# EAGLE schematic driver_schnellx (EAGLE 5.11)
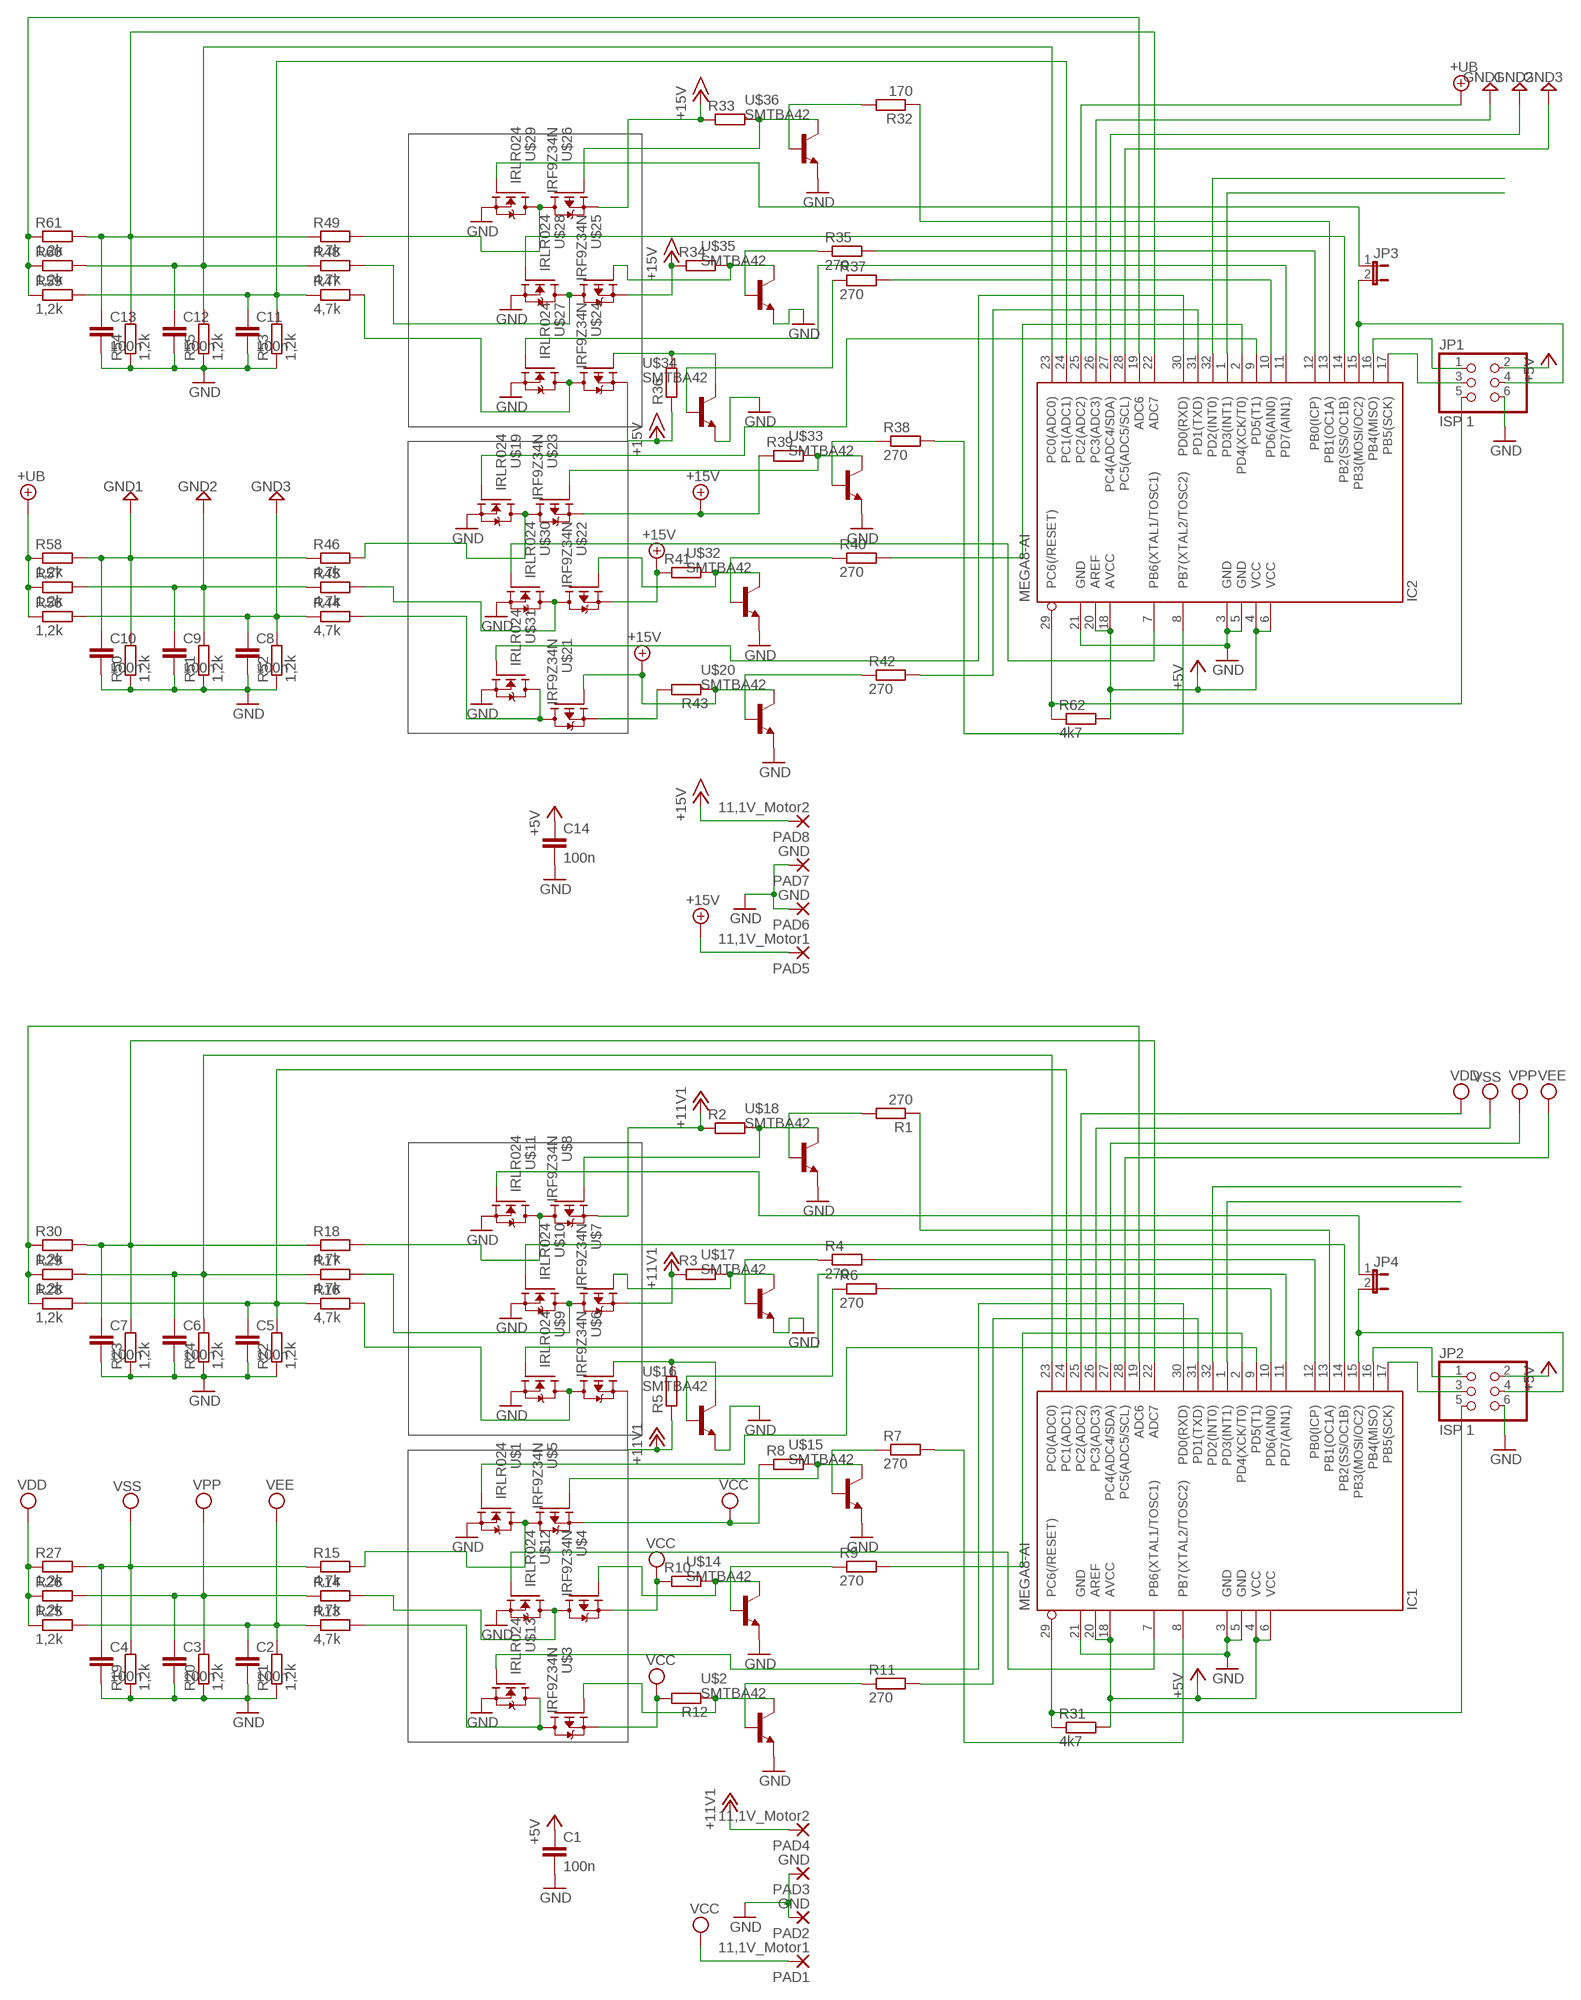
[diagram p0: schematic, sheet 1]

## Parts
C1  100n  C-EUC0805  [C0805]
C2  100n  C-EUC0805  [C0805]
C3  100n  C-EUC0805  [C0805]
C4  100n  C-EUC0805  [C0805]
C5  100n  C-EUC0805  [C0805]
C6  100n  C-EUC0805  [C0805]
C7  100n  C-EUC0805  [C0805]
C8  100n  C-EUC0805  [C0805]
C9  100n  C-EUC0805  [C0805]
C10  100n  C-EUC0805  [C0805]
C11  100n  C-EUC0805  [C0805]
C12  100n  C-EUC0805  [C0805]
C13  100n  C-EUC0805  [C0805]
C14  100n  C-EUC0805  [C0805]
IC1  MEGA8-AI  [TQFP32-08]
IC2  MEGA8-AI  [TQFP32-08]
JP1  ISP 1  PINHD-2X3  [2X03]
JP2  ISP 1  PINHD-2X3  [2X03]
JP3  JP1E  [JP1]
JP4  JP1E  [JP1]
PAD1  11,1V_Motor1  3,17/1,3  [3,17/1,3]
PAD2  GND  3,17/1,3  [3,17/1,3]
PAD3  GND  3,17/1,3  [3,17/1,3]
PAD4  11,1V_Motor2  3,17/1,3  [3,17/1,3]
PAD5  11,1V_Motor1  3,17/1,3  [3,17/1,3]
PAD6  GND  3,17/1,3  [3,17/1,3]
PAD7  GND  3,17/1,3  [3,17/1,3]
PAD8  11,1V_Motor2  3,17/1,3  [3,17/1,3]
R1  270  R-EU_M0805  [M0805]
R2  R-EU_0204/5  [0204/5]
R3  R-EU_0204/5  [0204/5]
R4  270  R-EU_M0805  [M0805]
R5  R-EU_0204/5  [0204/5]
R6  270  R-EU_M0805  [M0805]
R7  270  R-EU_M0805  [M0805]
R8  R-EU_0204/5  [0204/5]
R9  270  R-EU_M0805  [M0805]
R10  R-EU_0204/5  [0204/5]
R11  270  R-EU_M0805  [M0805]
R12  R-EU_0204/5  [0204/5]
R13  4,7k  R-EU_M0805  [M0805]
R14  4,7k  R-EU_M0805  [M0805]
R15  4,7k  R-EU_M0805  [M0805]
R16  4,7k  R-EU_M0805  [M0805]
R17  4,7k  R-EU_M0805  [M0805]
R18  4,7k  R-EU_M0805  [M0805]
R19  1,2k  R-EU_M0805  [M0805]
R20  1,2k  R-EU_M0805  [M0805]
R21  1,2k  R-EU_M0805  [M0805]
R22  1,2k  R-EU_M0805  [M0805]
R23  1,2k  R-EU_M0805  [M0805]
R24  1,2k  R-EU_M0805  [M0805]
R25  1,2k  R-EU_M0805  [M0805]
R26  1,2k  R-EU_M0805  [M0805]
R27  1,2k  R-EU_M0805  [M0805]
R28  1,2k  R-EU_M0805  [M0805]
R29  1,2k  R-EU_M0805  [M0805]
R30  1,2k  R-EU_M0805  [M0805]
R31  4k7  R-EU_M0805  [M0805]
R32  170  R-EU_M0805  [M0805]
R33  R-EU_0204/5  [0204/5]
R34  R-EU_0204/5  [0204/5]
R35  270  R-EU_M0805  [M0805]
R36  R-EU_0204/5  [0204/5]
R37  270  R-EU_M0805  [M0805]
R38  270  R-EU_M0805  [M0805]
R39  R-EU_0204/5  [0204/5]
R40  270  R-EU_M0805  [M0805]
R41  R-EU_0204/5  [0204/5]
R42  270  R-EU_M0805  [M0805]
R43  R-EU_0204/5  [0204/5]
R44  4,7k  R-EU_M0805  [M0805]
R45  4,7k  R-EU_M0805  [M0805]
R46  4,7k  R-EU_M0805  [M0805]
R47  4,7k  R-EU_M0805  [M0805]
R48  4,7k  R-EU_M0805  [M0805]
R49  4,7k  R-EU_M0805  [M0805]
R50  1,2k  R-EU_M0805  [M0805]
R51  1,2k  R-EU_M0805  [M0805]
R52  1,2k  R-EU_M0805  [M0805]
R53  1,2k  R-EU_M0805  [M0805]
R54  1,2k  R-EU_M0805  [M0805]
R55  1,2k  R-EU_M0805  [M0805]
R56  1,2k  R-EU_M0805  [M0805]
R57  1,2k  R-EU_M0805  [M0805]
R58  1,2k  R-EU_M0805  [M0805]
R59  1,2k  R-EU_M0805  [M0805]
R60  1,2k  R-EU_M0805  [M0805]
R61  1,2k  R-EU_M0805  [M0805]
R62  4k7  R-EU_M0805  [M0805]
U$1  IRLR024  [TO252]
U$2  SMTBA42  [SOT23-BEC]
U$3  IRF9Z34N  [TO220V]
U$4  IRF9Z34N  [TO220V]
U$5  IRF9Z34N  [TO220V]
U$6  IRF9Z34N  [TO220V]
U$7  IRF9Z34N  [TO220V]
U$8  IRF9Z34N  [TO220V]
U$9  IRLR024  [TO252]
U$10  IRLR024  [TO252]
U$11  IRLR024  [TO252]
U$12  IRLR024  [TO252]
U$13  IRLR024  [TO252]
U$14  SMTBA42  [SOT23-BEC]
U$15  SMTBA42  [SOT23-BEC]
U$16  SMTBA42  [SOT23-BEC]
U$17  SMTBA42  [SOT23-BEC]
U$18  SMTBA42  [SOT23-BEC]
U$19  IRLR024  [TO252]
U$20  SMTBA42  [SOT23-BEC]
U$21  IRF9Z34N  [TO220V]
U$22  IRF9Z34N  [TO220V]
U$23  IRF9Z34N  [TO220V]
U$24  IRF9Z34N  [TO220V]
U$25  IRF9Z34N  [TO220V]
U$26  IRF9Z34N  [TO220V]
U$27  IRLR024  [TO252]
U$28  IRLR024  [TO252]
U$29  IRLR024  [TO252]
U$30  IRLR024  [TO252]
U$31  IRLR024  [TO252]
U$32  SMTBA42  [SOT23-BEC]
U$33  SMTBA42  [SOT23-BEC]
U$34  SMTBA42  [SOT23-BEC]
U$35  SMTBA42  [SOT23-BEC]
U$36  SMTBA42  [SOT23-BEC]

## Nets
+5V: C1.1 C14.1 IC1.4(VCC) IC1.6(VCC) IC1.18(AVCC) IC1.20(AREF) IC2.4(VCC) IC2.6(VCC) IC2.18(AVCC) IC2.20(AREF) JP1.2 JP2.2 R31.2 R62.2
+12V: PAD4.1(P) R2.1 R3.1 R5.1 U$6.3(S) U$7.3(S) U$8.3(S) ; supply symbol labelled +11V1
+15V: PAD5.1(P) PAD8.1(P) R33.1 R34.1 R36.1 R39.1 R41.1 R43.1 U$20.C U$21.1(G) U$22.3(S) U$23.3(S) U$24.3(S) U$25.3(S) U$26.3(S)
+UB: IC2.25(PC2(ADC2)) R56.1 R57.1 R58.1
GND: C1.2 C2.2 C3.2 C4.2 C5.2 C6.2 C7.2 C8.2 C9.2 C10.2 C11.2 C12.2 C13.2 C14.2 IC1.3(GND) IC1.5(GND) IC1.21(GND) IC2.3(GND) IC2.5(GND) IC2.21(GND) JP1.6 JP2.6 PAD2.1(P) PAD3.1(P) PAD6.1(P) PAD7.1(P) R19.1 R20.1 R21.1 R22.1 R23.1 R24.1 R50.1 R51.1 R52.1 R53.1 R54.1 R55.1 U$1.2(S) U$2.E U$9.2(S) U$10.2(S) U$11.2(S) U$12.2(S) U$13.2(S) U$14.E U$15.E U$16.E U$17.E U$18.E U$19.2(S) U$20.E U$27.2(S) U$28.2(S) U$29.2(S) U$30.2(S) U$31.2(S) U$32.E U$33.E U$34.E U$35.E U$36.E
GND1: C10.1 IC2.26(PC3(ADC3)) R46.1 R50.2 R58.2
GND2: C9.1 IC2.27(PC4(ADC4/SDA)) R45.1 R51.2 R57.2
GND3: C8.1 IC2.28(PC5(ADC5/SCL)) R44.1 R52.2 R56.2
N$1: R16.2 U$6.2(D) U$9.3(D)
N$2: IC1.16(PB4(MISO)) JP2.1
N$3: C5.1 IC1.24(PC1(ADC1)) R16.1 R22.2 R28.2
N$4: JP4.1 U$11.1(G)
N$5: IC1.14(PB2(SS/OC1B)) U$10.1(G)
N$6: IC1.13(PB1(OC1A)) R1.1
N$7: R12.1 U$2.C U$3.1(G)
N$8: R8.2 U$5.1(G) U$15.C
N$9: R10.2 U$4.1(G) U$14.C
N$10: R9.1 U$14.B
N$11: C6.1 IC1.23(PC0(ADC0)) R17.1 R24.2 R29.2
N$12: C7.1 IC1.22(ADC7) R18.1 R23.2 R30.2
N$13: R7.1 U$15.B
N$14: IC1.8(PB7(XTAL2/TOSC2)) R7.2
N$15: IC1.19(ADC6) R28.1 R29.1 R30.1
N$16: R47.2 U$24.2(D) U$27.3(D)
N$17: R2.2 U$8.1(G) U$18.C
N$18: R1.2 U$18.B
N$19: R18.2 U$8.2(D) U$11.3(D)
N$20: R17.2 U$7.2(D) U$10.3(D)
N$21: IC1.11(PD7(AIN1)) U$9.1(G)
N$22: IC1.12(PB0(ICP)) R4.2
N$23: IC1.10(PD6(AIN0)) R6.2
N$24: R13.2 U$3.2(D) U$13.3(D)
N$25: IC1.9(PD5(T1)) U$1.1(G)
N$26: R3.2 U$7.1(G) U$17.C
N$27: IC1.7(PB6(XTAL1/TOSC1)) U$12.1(G)
N$28: R15.2 U$1.3(D) U$5.2(D)
N$29: R14.2 U$4.2(D) U$12.3(D)
N$30: IC1.2(PD4(XCK/T0)) R9.2
N$31: IC1.30(PD0(RXD)) U$13.1(G)
N$32: IC1.31(PD1(TXD)) R11.2
N$33: R4.1 U$17.B
N$34: R5.2 U$6.1(G) U$16.C
N$35: R6.1 U$16.B
N$36: R11.1 U$2.B
N$37: IC2.1(PD3(INT1))
N$38: JP3.1 U$29.1(G)
N$39: IC2.13(PB1(OC1A)) R32.1
N$40: IC1.17(PB5(SCK)) JP2.3
N$41: IC2.14(PB2(SS/OC1B)) U$28.1(G)
N$42: IC1.29(PC6(/RESET)) JP2.5 R31.1
N$43: R49.2 U$26.2(D) U$29.3(D)
N$44: R48.2 U$25.2(D) U$28.3(D)
N$45: IC2.11(PD7(AIN1)) U$27.1(G)
N$46: R44.2 U$21.2(D) U$31.3(D)
N$47: IC2.9(PD5(T1)) U$19.1(G)
N$48: IC2.7(PB6(XTAL1/TOSC1)) U$30.1(G)
N$49: R46.2 U$19.3(D) U$23.2(D)
N$50: R45.2 U$22.2(D) U$30.3(D)
N$51: IC2.32(PD2(INT0))
N$52: R41.2 U$22.1(G) U$32.C
N$53: R40.1 U$32.B
N$54: R39.2 U$23.1(G) U$33.C
N$55: R38.1 U$33.B
N$56: R33.2 U$26.1(G) U$36.C
N$57: R32.2 U$36.B
N$58: IC2.12(PB0(ICP)) R35.2
N$59: IC2.10(PD6(AIN0)) R37.2
N$60: R34.2 U$25.1(G) U$35.C
N$61: R35.1 U$35.B
N$62: R36.2 U$24.1(G) U$34.C
N$63: R37.1 U$34.B
N$64: R42.1 U$20.B
N$65: IC2.2(PD4(XCK/T0)) R40.2
N$66: C11.1 IC2.24(PC1(ADC1)) R47.1 R53.2 R59.2
N$67: C12.1 IC2.23(PC0(ADC0)) R48.1 R55.2 R60.2
N$68: C13.1 IC2.22(ADC7) R49.1 R54.2 R61.2
N$69: IC2.19(ADC6) R59.1 R60.1 R61.1
N$70: IC2.29(PC6(/RESET)) JP1.5 R62.1
N$71: IC2.16(PB4(MISO)) JP1.1
N$72: IC2.17(PB5(SCK)) JP1.3
N$73: IC2.30(PD0(RXD)) U$31.1(G)
N$74: IC2.31(PD1(TXD)) R42.2
N$75: IC2.8(PB7(XTAL2/TOSC2)) R38.2
N$76: IC1.1(PD3(INT1))
N$77: IC1.32(PD2(INT0))
N$78: R43.2 U$21.3(S)
N$79: IC2.15(PB3(MOSI/OC2)) JP1.4 JP3.2
N$80: IC1.15(PB3(MOSI/OC2)) JP2.4 JP4.2
VCC: PAD1.1(P) R8.1 R10.1 R12.2 U$3.3(S) U$4.3(S) U$5.3(S)
VDD: IC1.25(PC2(ADC2)) R25.1 R26.1 R27.1
VEE: C2.1 IC1.28(PC5(ADC5/SCL)) R13.1 R21.2 R25.2
VPP: C3.1 IC1.27(PC4(ADC4/SDA)) R14.1 R20.2 R26.2
VSS: C4.1 IC1.26(PC3(ADC3)) R15.1 R19.2 R27.2

## Library data of the parts
C1-C14 = rcl:C-EU: CAPACITOR, European symbol
IC1 IC2 = atmel:MEGA8: MICROCONTROLLER 8 Kbytes FLASH, 1 kbytes SRAM, 512 bytes EEPROM, USART, 6-channel 10 bit ADC, 2-channel 8 bit ADC Pin compatible with Atmega48, ATMega88, ATMega168 Source: avr.lbr; MPN: ATMEGA8-16AU; OC_FARNELL: 9171371; OC_NEWARK: 73M8863
JP1 JP2 = pinhead:PINHD-2X3: PIN HEADER
JP3 JP4 = jumper:JP1E: JUMPER
PAD1-PAD8 = wirepad:3,17/1,3: THROUGH-HOLE PAD
R1-R62 = rcl:R-EU_: RESISTOR, European symbol
U$1 U$9-U$13 U$19 U$27-U$31 = transistor-fet:IRLR024: MOSFET - by AlKi
U$2 U$14-U$18 U$20 U$32-U$36 = transistor-npn:SMTBA42
U$3-U$8 U$21-U$26 = transistor-fet:IRF9Z34N